# Altium schematic sheet 02_IMU.SchDoc
size A4
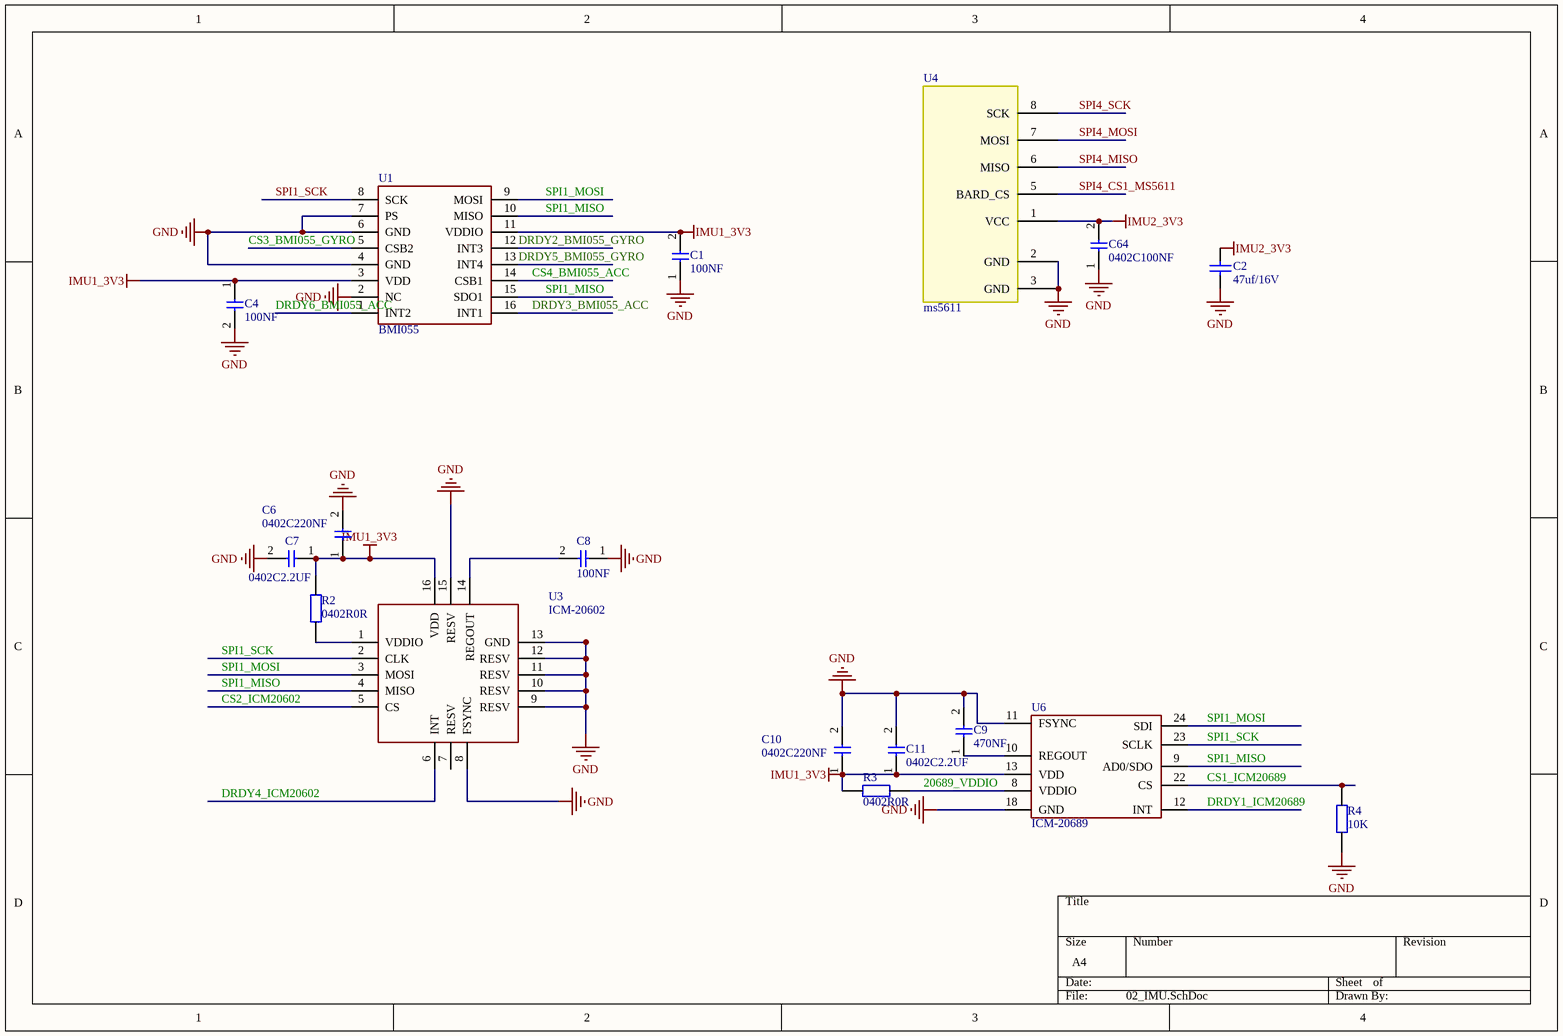
[diagram p0: 02_IMU.SchDoc]

## Parts
C1  100NF  [0402C]
C2  47uf/16V  [0805CAP]
C4  100NF  [0402C]
C6  0402C220NF  [0402C]
C7  0402C2.2UF  [0402C]
C8  100NF  [0402C]
C9  470NF  [0402C]
C10  0402C220NF  [0402C]
C11  0402C2.2UF  [0402C]
C64  0402C100NF  [0402C]
R2  0402R0R  [0402R]
R3  0402R0R  [0402R]
R4  10K  [0402R]
U1  BMI055  [LGA16_BMI055]
U3  ICM-20602  [LGA16]
U4  ms5611  [ms5611]
U6  ICM-20689  [QFN24]

## Nets
GND: C1.1 C2.2 C4.2 C6.2 C7.2 C8.1 C9.2 C10.2 C11.2 C64.1 R4.1 U1.2(NC) U1.4(GND) U1.6(GND) U1.7(PS) U3.8(FSYNC) U3.9(RESV) U3.10(RESV) U3.11(RESV) U3.12(RESV) U3.13(GND) U3.15(RESV) U4.2(GND) U4.3(GND) U6.11(FSYNC) U6.18(GND)
IMU1_3V3: C1.2 C4.1 C6.1 C7.1 C10.1 C11.1 R2.2 R3.1 U1.3(VDD) U1.11(VDDIO) U3.16(VDD) U6.13(VDD)
IMU2_3V3: C2.1 C64.2 U4.1(VCC)
20689_VDDIO: R3.2 U6.8(VDDIO)
CS1_ICM20689: R4.2 U6.22(CS)
CS2_ICM20602: U3.5(CS)
CS3_BMI055_GYRO: U1.5(CSB2)
CS4_BMI055_ACC: U1.14(CSB1)
DRDY1_ICM20689: U6.12(INT)
DRDY2_BMI055_GYRO: U1.12(INT3)
DRDY3_BMI055_ACC: U1.16(INT1)
DRDY4_ICM20602: U3.6(INT)
DRDY5_BMI055_GYRO: U1.13(INT4)
DRDY6_BMI055_ACC: U1.1(INT2)
SPI1_MISO: U1.10(MISO) U1.15(SDO1) U3.4(MISO) U6.9(AD0/SDO)
SPI1_MOSI: U1.9(MOSI) U3.3(MOSI) U6.24(SDI)
SPI1_SCK: U1.8(SCK) U3.2(CLK) U6.23(SCLK)
SPI4_CS1_MS5611: U4.5(BARD_CS)
SPI4_MISO: U4.6(MISO)
SPI4_MOSI: U4.7(MOSI)
SPI4_SCK: U4.8(SCK)
NetC8_2: C8.2 U3.14(REGOUT)
NetC9_1: C9.1 U6.10(REGOUT)
NetR2_1: R2.1 U3.1(VDDIO)

Not connected (* = marked no-connect by the designer): U3 7(RESV)

## Library data of the parts
C1 C4 C8 = 0402C220NF
C2 = Cap: Capacitor
C9 = 0402C2.2UF
C64 = 0402C100NF: 50V 5%
R2-R4 = 0402R0R: 0402R0R 1%